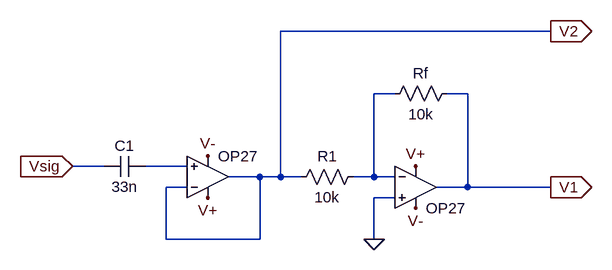
[diagram p0: schematic Draft1.asc]
Draft1.asc, the LTspice schematic file:
Version 4.1
SHEET 1 880 680
WIRE 704 -144 288 -144
WIRE 464 -48 432 -48
WIRE 576 -48 544 -48
WIRE 16 64 -32 64
WIRE 144 64 80 64
WIRE 256 80 208 80
WIRE 288 80 288 -144
WIRE 288 80 256 80
WIRE 320 80 288 80
WIRE 432 80 432 -48
WIRE 432 80 400 80
WIRE 464 80 432 80
WIRE 144 96 112 96
WIRE 576 96 576 -48
WIRE 576 96 528 96
WIRE 704 96 576 96
WIRE 464 112 432 112
WIRE 112 176 112 96
WIRE 256 176 256 80
WIRE 256 176 112 176
WIRE 432 176 432 112
FLAG 496 64 V+
FLAG 176 112 V+
FLAG 176 48 V-
FLAG 496 128 V-
FLAG 432 176 0
FLAG -32 64 Vsig
IOPIN -32 64 In
FLAG 704 -144 V2
IOPIN 704 -144 Out
FLAG 704 96 V1
IOPIN 704 96 Out
SYMBOL OpAmps\\OP27 176 144 M180
WINDOW 0 16 32 Invisible 2
SYMATTR InstName U1
SYMBOL OpAmps\\OP27 496 32 R0
WINDOW 0 16 32 Invisible 2
SYMATTR InstName U2
SYMBOL cap 80 48 R90
WINDOW 0 0 32 VBottom 2
WINDOW 3 32 32 VTop 2
SYMATTR InstName C1
SYMATTR Value 33n
SYMBOL res 304 96 R270
WINDOW 0 32 56 VTop 2
WINDOW 3 0 56 VBottom 2
SYMATTR InstName R1
SYMATTR Value 10k
SYMBOL res 448 -32 R270
WINDOW 0 32 56 VTop 2
WINDOW 3 0 56 VBottom 2
SYMATTR InstName Rf
SYMATTR Value 10k

The netlist it stands for:
* Draft1.asc
X§U1 N002 V2 V+ V- V2 OP27  ; pins In+ In- V+ V- OUT
X§U2 0 N001 V+ V- V1 OP27  ; pins In+ In- V+ V- OUT
C1 N002 Vsig 33n
R1 V2 N001 10k
Rf N001 V1 10k
.lib ADI.lib
.backanno
.end